# Altium schematic sheet CumLED.SchDoc
size A
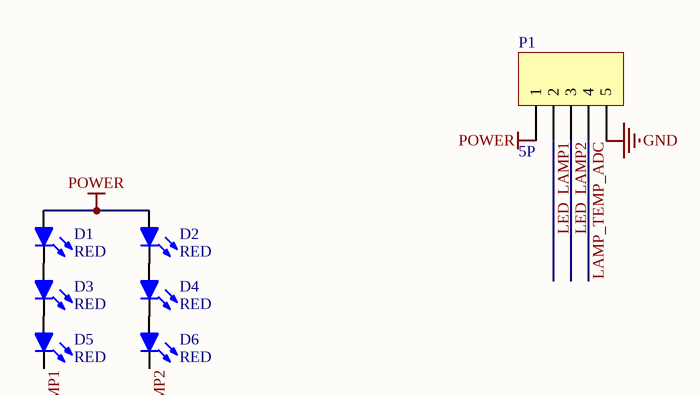
[diagram p0: CumLED.SchDoc]

## Parts
D1  value RED  [led_luxeon]
D2  value RED  [led_luxeon]
D3  value RED  [led_luxeon]
D4  value RED  [led_luxeon]
D5  value RED  [led_luxeon]
D6  value RED  [led_luxeon]
P1  value 5P  [HDR1X5H]  (hidden comment: Jump đực chân thẳng, 2.54mm 5P)

## Nets
GND: P1.5
POWER: D1.1(A) D2.1(A) P1.1
LAMP_TEMP_ADC: P1.4
LED_LAMP1: D5.2(K) P1.2
LED_LAMP2: D6.2(K) P1.3
NetD1_2: D1.2(K) D3.1(A)
NetD2_2: D2.2(K) D4.1(A)
NetD3_2: D3.2(K) D5.1(A)
NetD4_2: D4.2(K) D6.1(A)

## Library data of the parts
D1-D6 = LED0: Typical INFRARED GaAs LED; Type1: LED dán 0805; Type2: LED chân cắm 3mm; Type3: LED chân cắm 5mm; Published: *; LatestRevisionDate: *; LatestRevisionNote: *; PackageReference: *; Publisher: *
P1 = Header 5H: Header, 5-Pin, Right Angle; LatestRevisionDate: 17-Jul-2002; LatestRevisionNote: Re-released for DXP Platform.; Publisher: Altium Limited